# Altium schematic sheet DC_LINK.SchDoc
size A4
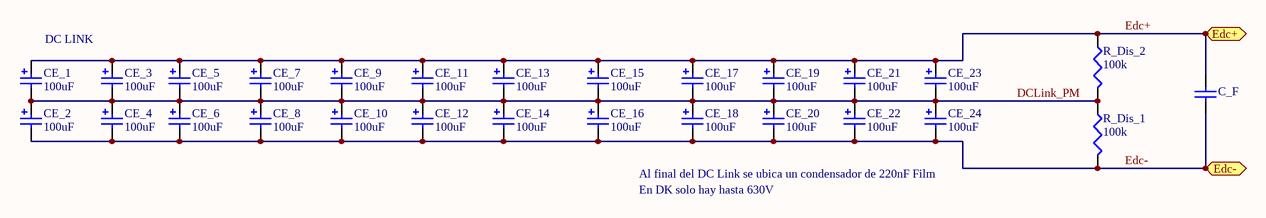
[diagram p0: DC_LINK.SchDoc]

## Parts
C_F  Cap Semi  [CF_NN]  (value not drawn)
CE_1  100uF  [COND_ELECTRO]
CE_2  100uF  [COND_ELECTRO]
CE_3  100uF  [COND_ELECTRO]
CE_4  100uF  [COND_ELECTRO]
CE_5  100uF  [COND_ELECTRO]
CE_6  100uF  [COND_ELECTRO]
CE_7  100uF  [COND_ELECTRO]
CE_8  100uF  [COND_ELECTRO]
CE_9  100uF  [COND_ELECTRO]
CE_10  100uF  [COND_ELECTRO]
CE_11  100uF  [COND_ELECTRO]
CE_12  100uF  [COND_ELECTRO]
CE_13  100uF  [COND_ELECTRO]
CE_14  100uF  [COND_ELECTRO]
CE_15  100uF  [COND_ELECTRO]
CE_16  100uF  [COND_ELECTRO]
CE_17  100uF  [COND_ELECTRO]
CE_18  100uF  [COND_ELECTRO]
CE_19  100uF  [COND_ELECTRO]
CE_20  100uF  [COND_ELECTRO]
CE_21  100uF  [COND_ELECTRO]
CE_22  100uF  [COND_ELECTRO]
CE_23  100uF  [COND_ELECTRO]
CE_24  100uF  [COND_ELECTRO]
R_Dis_1  100k  [TO-220]
R_Dis_2  100k  [TO-220]

## Ports
Edc+ (bidir), Edc- (bidir)

## Nets
DCLink_PM: CE_1.2(N) CE_2.1(P) CE_3.2(N) CE_4.1(P) CE_5.2(N) CE_6.1(P) CE_7.2(N) CE_8.1(P) CE_9.2(N) CE_10.1(P) CE_11.2(N) CE_12.1(P) CE_13.2(N) CE_14.1(P) CE_15.2(N) CE_16.1(P) CE_17.2(N) CE_18.1(P) CE_19.2(N) CE_20.1(P) CE_21.2(N) CE_22.1(P) CE_23.2(N) CE_24.1(P) R_Dis_1.1 R_Dis_2.2
Edc+: C_F.2 CE_1.1(P) CE_3.1(P) CE_5.1(P) CE_7.1(P) CE_9.1(P) CE_11.1(P) CE_13.1(P) CE_15.1(P) CE_17.1(P) CE_19.1(P) CE_21.1(P) CE_23.1(P) R_Dis_2.1 ; port Edc+
Edc-: C_F.1 CE_2.2(N) CE_4.2(N) CE_6.2(N) CE_8.2(N) CE_10.2(N) CE_12.2(N) CE_14.2(N) CE_16.2(N) CE_18.2(N) CE_20.2(N) CE_22.2(N) CE_24.2(N) R_Dis_1.2 ; port Edc-

## Notes on the sheet
- DC LINK
- Al final del DC Link se ubica un condensador de 220nF Film
- En DK solo hay hasta 630V

## Library data of the parts
C_F = Cap Semi: CAP FILM 0.22UF 10% 1KVDC RADIAL; Manufacturer Part Number: R71QR32204000K; Digi-Key Part Number: 399-12820-ND; RS Part Number: *
CE_1-CE_24 = Condensador DC-Link: Value: 100uF
R_Dis_1 R_Dis_2 = Res3: RES 100K OHM 25W 1% TO220; Manufacturer Part Number: MP925-100K-1%; Digi-Key Part Number: MP925-100KF-ND; RS Part Number: *